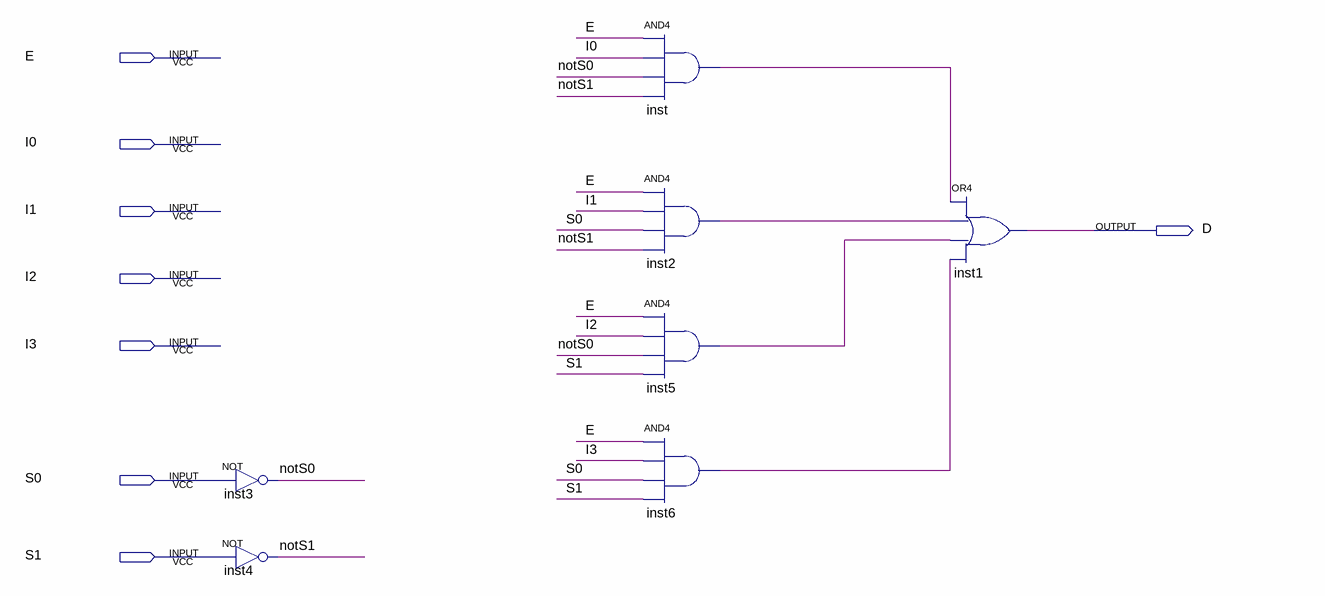
[diagram p0: schematic sheet]
// Quartus schematic mp4-2_1.bdf as structural Verilog: 7 symbols, 8 pins
module \mp4-2_1  (
  input  E,
  input  I0,
  input  I1,
  input  I2,
  input  I3,
  input  S0,
  input  S1,
  output D
);

  wire inst2_out, inst5_out, inst6_out, inst_out, notS0, notS1;

  not inst3 (notS0, S0);
  not inst4 (notS1, S1);
  and inst (inst_out, E, I0, notS0, notS1);
  and inst2 (inst2_out, E, I1, S0, notS1);
  and inst5 (inst5_out, E, I2, notS0, S1);
  and inst6 (inst6_out, E, I3, S0, S1);
  or inst1 (D, inst_out, inst2_out, inst5_out, inst6_out);
endmodule
